# Altium project VESC_STM32F405.PrjPcb
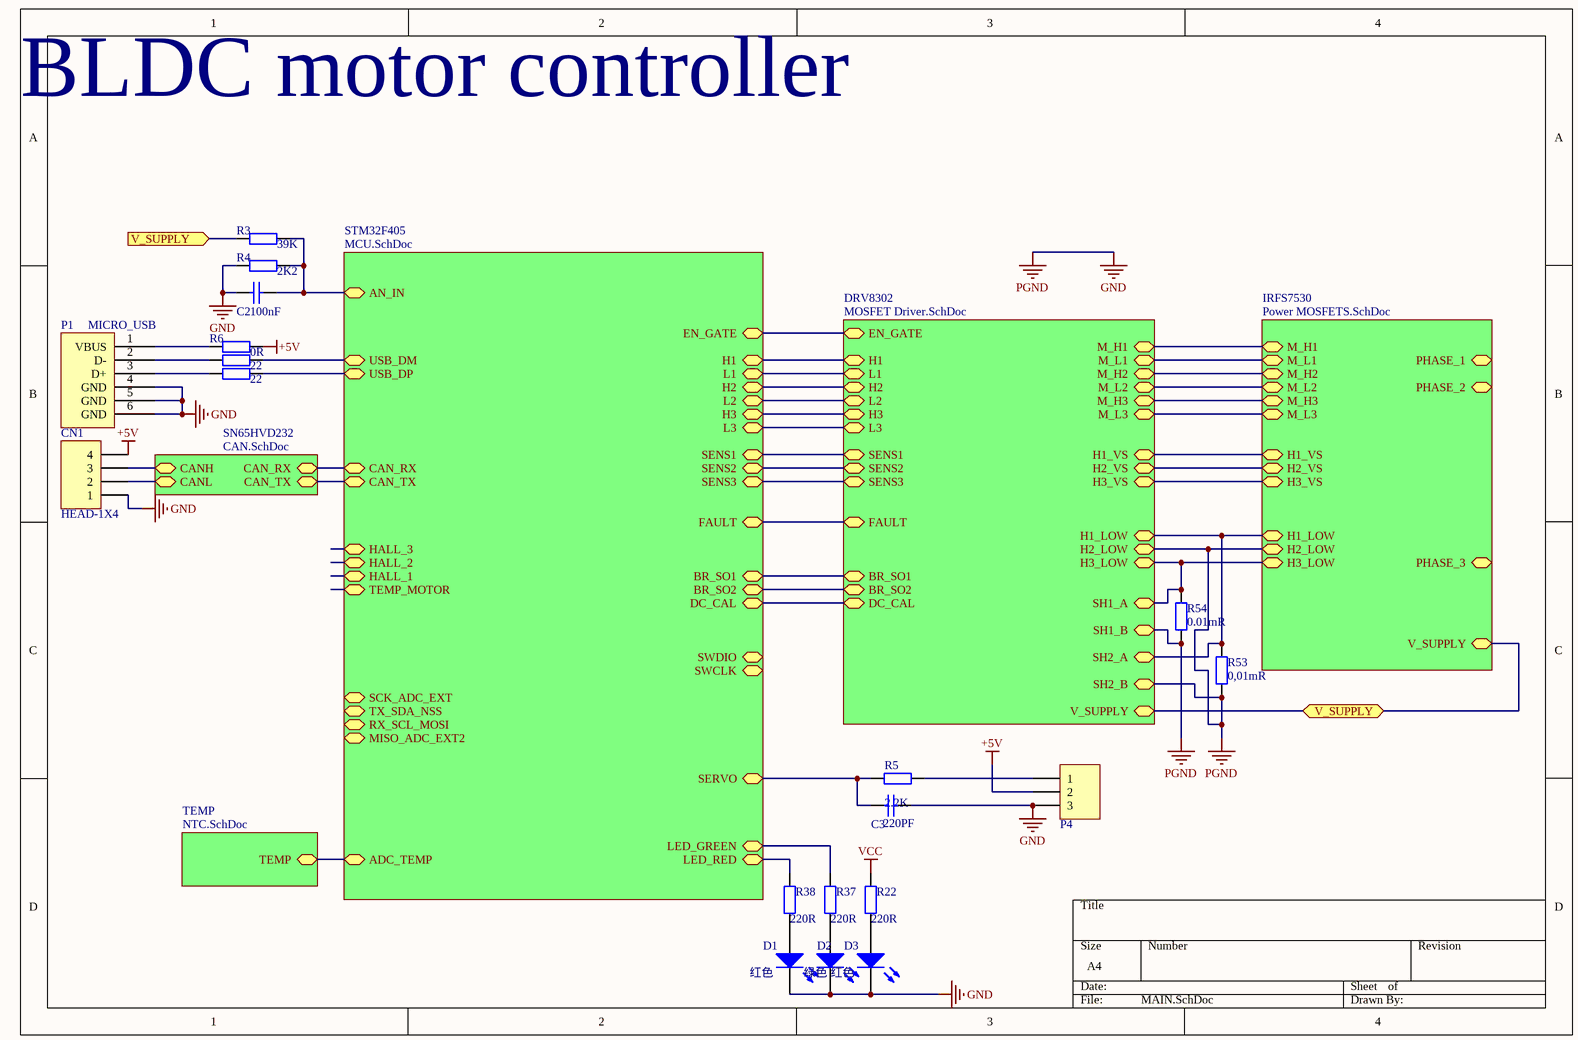
[diagram p0: MAIN.SchDoc]
6 sheets, 112 parts. Net scope: hierarchical (ports join the sheet entries above them; power ports are global).
Board file: VESC_909.PcbDoc
Sheets:
  MAIN.SchDoc
    STM32F405 = MCU.SchDoc
    DRV8302 = MOSFET Driver.SchDoc
    IRFS7530 = Power MOSFETS.SchDoc
    SN65HVD232 = CAN.SchDoc
    TEMP = NTC.SchDoc

## Sheet MAIN.SchDoc
size A4

### Parts
C2  value 100nF  [C-0603]  (hidden comment: CAP)
C3  220PF  [C-0603]
CN1  HEAD-1X4  [H-1X4]
D1  红色  [LED0603]
D2  绿色  [LED0603]
D3  红色  [LED0603]
P1  MICRO_USB  [MicroUSB]
P4  Header 3  [HDR3X1_A]  (value not drawn)
R3  39K  [0402]
R4  value 2K2  [0402]  (hidden comment: 2.2K)
R5  2.2K  [0402]
R6  0R  [0603-2]
R14  value 22  [LC-0402]  (hidden comment: 22R)
R15  value 22  [LC-0402]  (hidden comment: 22R)
R22  220R  [0402]
R37  220R  [0402]
R38  220R  [0402]
R53  value 0,01mR  [2512]  (hidden comment: 0.001R)
R54  value 0.01mR  [2512]  (hidden comment: 0.001R)

### Sub-sheets
DRV8302 = MOSFET Driver.SchDoc: DC_CAL, BR_SO2, BR_SO1, FAULT, SENS3, SENS2, SENS1, L3, H3, L2, H2, L1, H1, EN_GATE, M_H1, M_L1, M_H2, M_L2, M_H3, M_L3, H1_VS, H2_VS, H3_VS, H1_LOW, H2_LOW, H3_LOW, SH1_A, SH1_B, SH2_A, SH2_B, V_SUPPLY
IRFS7530 = Power MOSFETS.SchDoc: M_H1, M_L1, M_H2, M_L2, M_H3, M_L3, H1_VS, H2_VS, H3_VS, H1_LOW, H2_LOW, H3_LOW, PHASE_3, PHASE_2, PHASE_1, V_SUPPLY
SN65HVD232 = CAN.SchDoc: CANH, CANL, CAN_TX, CAN_RX
STM32F405 = MCU.SchDoc: AN_IN, USB_DM, USB_DP, CAN_RX, CAN_TX, HALL_3, HALL_2, HALL_1, TEMP_MOTOR, SCK_ADC_EXT, TX_SDA_NSS, RX_SCL_MOSI, MISO_ADC_EXT2, ADC_TEMP, EN_GATE, H1, L1, L2, H2, H3, L3, SENS1, SENS2, SENS3, FAULT, BR_SO1, BR_SO2, DC_CAL, SERVO, LED_GREEN, LED_RED, SWDIO, SWCLK
TEMP = NTC.SchDoc: TEMP

### Ports
V_SUPPLY, V_SUPPLY (in)

### Nets
+5V: CN1.4 P4.2 R6.2
GND: C2.1 C3.2 CN1.1 D1.2(K) D2.2(K) D3.2(K) P1.4(GND) P1.5(GND) P1.6(GND) P4.3 R4.1 R53.2 R54.2 ; sheet DRV8302/H2_LOW, sheet DRV8302/SH1_B, sheet DRV8302/SH2_B, sheet IRFS7530/H2_LOW  [also labelled PGND]
VCC: R22.2
NetC1_2: R3.1 ; port V_SUPPLY, sheet DRV8302/V_SUPPLY, sheet IRFS7530/V_SUPPLY
NetC2_2: C2.2 R3.2 R4.2 ; sheet STM32F405/AN_IN
NetC3_1: C3.1 R5.1 ; sheet STM32F405/SERVO
NetC28_2: sheet DRV8302/H1_VS, sheet IRFS7530/H1_VS, sheet IRFS7530/PHASE_1
NetC29_2: sheet DRV8302/H2_VS, sheet IRFS7530/H2_VS, sheet IRFS7530/PHASE_2
NetC30_2: sheet DRV8302/H3_VS, sheet IRFS7530/H3_VS, sheet IRFS7530/PHASE_3
NetCN1_2: CN1.2 ; sheet SN65HVD232/CANL
NetCN1_3: CN1.3 ; sheet SN65HVD232/CANH
NetCN_2: sheet STM32F405/ADC_TEMP, sheet TEMP/TEMP
NetD1_1: D1.1(A) R38.1
NetD2_1: D2.1(A) R37.1
NetD3_1: D3.1(A) R22.1
NetP1_1: P1.1(VBUS) R6.1
NetP1_2: P1.2(D-) R14.1
NetP1_3: P1.3(D+) R15.1
NetP4_1: P4.1 R5.2
NetQ2_1: R53.1 ; sheet DRV8302/H1_LOW, sheet DRV8302/SH2_A, sheet IRFS7530/H1_LOW
NetQ6_1: R54.1 ; sheet DRV8302/H3_LOW, sheet DRV8302/SH1_A, sheet IRFS7530/H3_LOW
NetR14_2: R14.2 ; sheet STM32F405/USB_DM
NetR15_2: R15.2 ; sheet STM32F405/USB_DP
NetR23_2: sheet STM32F405/SENS1, sheet DRV8302/SENS1
NetR26_2: sheet STM32F405/SENS2, sheet DRV8302/SENS2
NetR28_1: sheet DRV8302/M_H1, sheet IRFS7530/M_H1
NetR29_1: sheet DRV8302/M_L1, sheet IRFS7530/M_L1
NetR32_2: sheet STM32F405/SENS3, sheet DRV8302/SENS3
NetR34_1: sheet DRV8302/M_H2, sheet IRFS7530/M_H2
NetR35_1: sheet DRV8302/M_L2, sheet IRFS7530/M_L2
NetR37_2: R37.2 ; sheet STM32F405/LED_GREEN
NetR38_2: R38.2 ; sheet STM32F405/LED_RED
NetR42_1: sheet DRV8302/M_H3, sheet IRFS7530/M_H3
NetR43_1: sheet DRV8302/M_L3, sheet IRFS7530/M_L3
NetU1_1: sheet STM32F405/CAN_TX, sheet SN65HVD232/CAN_TX
NetU1_4: sheet STM32F405/CAN_RX, sheet SN65HVD232/CAN_RX
NetU2_26: sheet STM32F405/BR_SO2, sheet DRV8302/BR_SO2
NetU2_27: sheet STM32F405/BR_SO1, sheet DRV8302/BR_SO1
NetU2_33: sheet STM32F405/DC_CAL, sheet DRV8302/DC_CAL
NetU2_34: sheet STM32F405/L3, sheet DRV8302/L3
NetU2_35: sheet STM32F405/L2, sheet DRV8302/L2
NetU2_36: sheet STM32F405/L1, sheet DRV8302/L1
NetU2_41: sheet STM32F405/H3, sheet DRV8302/H3
NetU2_42: sheet STM32F405/H2, sheet DRV8302/H2
NetU2_43: sheet STM32F405/H1, sheet DRV8302/H1
NetU2_51: sheet STM32F405/EN_GATE, sheet DRV8302/EN_GATE
NetU2_53: sheet STM32F405/FAULT, sheet DRV8302/FAULT

### Notes on the sheet
- BLDC motor controller

### Library data of the parts
C2 = CAP: Capacitor; Published: 8-Jun-2000; Revision: July-2002: Re-released for DXP Platform.; Publisher: Altium Limited
C3 = CAP: Capacitor; Value: 100nF; Published: 8-Jun-2000; Revision: July-2002: Re-released for DXP Platform.; Publisher: Altium Limited
CN1 = HEAD-1X4: Header, 4-Pin; LatestRevisionDate: 17-Jul-2002; LatestRevisionNote: Re-released for DXP Platform.; Publisher: Altium Limited
D1-D3 = LED2: Typical RED, GREEN, YELLOW, AMBER GaAs LED; Published: 8-Jun-2000; LatestRevisionDate: 17-Jul-2002; LatestRevisionNote: Re-released for DXP Platform.; PackageVersion: Feb-2002; PackageReference: 3.2X1.6X1.1; Publisher: Altium Limited
P1 = MINI_USB: pin to pad: 6>0
P4 = Header 3_1: 接插件; LatestRevisionDate: 17-Jul-2002; LatestRevisionNote: Re-released for DXP Platform.; Publisher: Altium Limited
R3 R4 R6 R14 R15 R53 R54 = Res1: 贴片电阻; Published: 8-Jun-2000; LatestRevisionDate: 17-Jul-2002; LatestRevisionNote: Re-released for DXP Platform.; PackageReference: AXIAL-0.4; Publisher: Altium Limited
  R3: Value: 39K
  R6: Value: 0R
R5 R22 = Res1: 贴片电阻; Value: 2k2; Published: 8-Jun-2000; LatestRevisionDate: 17-Jul-2002; LatestRevisionNote: Re-released for DXP Platform.; PackageReference: AXIAL-0.4; Publisher: Altium Limited
R37 R38 = Res1: 贴片电阻; Value: 220; Published: 8-Jun-2000; LatestRevisionDate: 17-Jul-2002; LatestRevisionNote: Re-released for DXP Platform.; PackageReference: AXIAL-0.4; Publisher: Altium Limited

## Sheet MCU.SchDoc
size A4
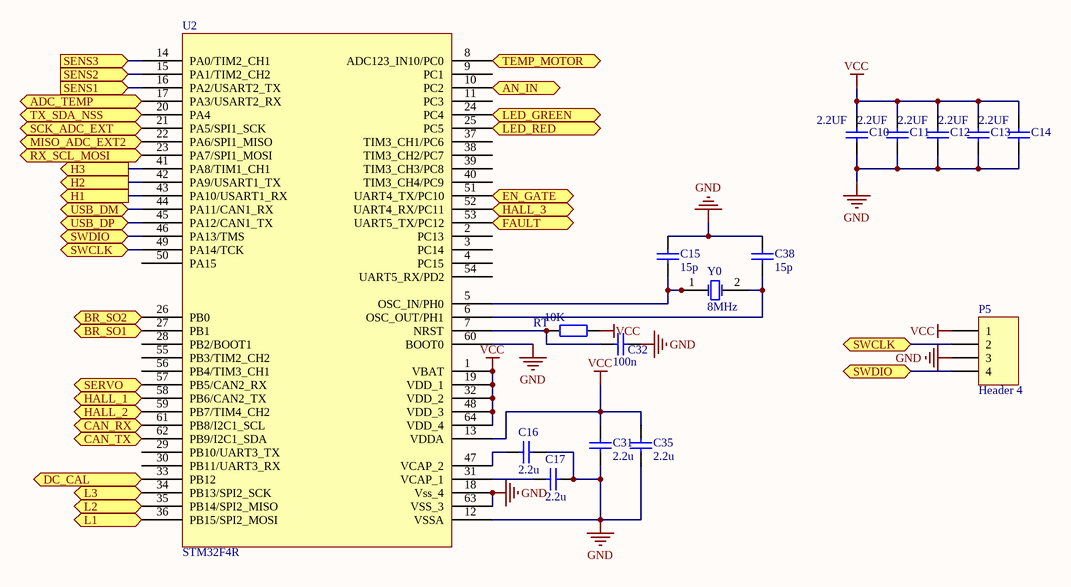
[diagram p1: MCU.SchDoc]

### Parts
C10  2.2UF  [C-0603]
C11  2.2UF  [C-0603]
C12  2.2UF  [C-0603]
C13  2.2UF  [C-0603]
C14  2.2UF  [C-0603]
C15  value 15p  [0402]  (hidden comment: 15PF)
C16  value 2.2u  [C-0603]  (hidden comment: 2.2UF)
C17  value 2.2u  [C-0603]  (hidden comment: 2.2UF)
C31  value 2.2u  [C-0603]  (hidden comment: 2.2UF)
C32  value 100n  [C-0603]  (hidden comment: 100NF)
C35  value 2.2u  [C-0603]  (hidden comment: 2.2UF)
C38  value 15p  [0402]  (hidden comment: 15PF)
P5  Header 4  [H-1X4]
RT  10K  [0603-2]
U2  STM32F4R  [STM32F4R]
Y0  8MHz  [XTAL_5032]

### Ports
ADC_TEMP, AN_IN (in), BR_SO1 (in), BR_SO2 (in), CAN_RX, CAN_TX, DC_CAL (in), EN_GATE (out), FAULT (in), H1 (out), H2 (out), H3 (out), HALL_1 (in), HALL_2 (in), HALL_3 (in), L1 (out), L2 (out), L3 (out), LED_GREEN (out), LED_RED (out), MISO_ADC_EXT2 (in), RX_SCL_MOSI (in), SCK_ADC_EXT (in), SENS1 (in), SENS2 (in), SENS3 (in), SERVO (out), SWCLK, SWDIO, TEMP_MOTOR (in), TX_SDA_NSS (in), USB_DM, USB_DP

### Nets
GND: C10.1 C11.1 C12.1 C13.1 C14.1 C15.2 C16.1 C17.1 C31.1 C32.1 C35.1 C38.2 P5.3 U2.12(VSSA) U2.18(Vss_4) U2.60(BOOT0) U2.63(VSS_3)
VCC: C10.2 C11.2 C12.2 C13.2 C14.2 C31.2 C35.2 P5.1 RT.2 U2.1(VBAT) U2.13(VDDA) U2.19(VDD_1) U2.32(VDD_2) U2.48(VDD_3) U2.64(VDD_4)
NetC2_2: U2.10(PC2) ; port AN_IN
NetC3_1: U2.57(PB5/CAN2_RX) ; port SERVO
NetC15_1: C15.1 U2.5(OSC_IN/PH0) Y0.1(OSC1)
NetC16_2: C16.2 U2.47(VCAP_2)
NetC17_2: C17.2 U2.31(VCAP_1)
NetC32_2: C32.2 RT.1 U2.7(NRST)
NetC38_1: C38.1 U2.6(OSC_OUT/PH1) Y0.2(OSC2)
NetCN_2: U2.17(PA3/USART2_RX) ; port ADC_TEMP
NetP5_2: P5.2 U2.49(PA14/TCK) ; port SWCLK
NetP5_4: P5.4 U2.46(PA13/TMS) ; port SWDIO
NetR14_2: U2.44(PA11/CAN1_RX) ; port USB_DM
NetR15_2: U2.45(PA12/CAN1_TX) ; port USB_DP
NetR23_2: U2.16(PA2/USART2_TX) ; port SENS1
NetR26_2: U2.15(PA1/TIM2_CH2) ; port SENS2
NetR32_2: U2.14(PA0/TIM2_CH1) ; port SENS3
NetR37_2: U2.24(PC4) ; port LED_GREEN
NetR38_2: U2.25(PC5) ; port LED_RED
NetU1_1: U2.62(PB9/I2C1_SDA) ; port CAN_TX
NetU1_4: U2.61(PB8/I2C1_SCL) ; port CAN_RX
NetU2_8: U2.8(ADC123_IN10/PC0) ; port TEMP_MOTOR
NetU2_20: U2.20(PA4) ; port TX_SDA_NSS
NetU2_21: U2.21(PA5/SPI1_SCK) ; port SCK_ADC_EXT
NetU2_22: U2.22(PA6/SPI1_MISO) ; port MISO_ADC_EXT2
NetU2_23: U2.23(PA7/SPI1_MOSI) ; port RX_SCL_MOSI
NetU2_26: U2.26(PB0) ; port BR_SO2
NetU2_27: U2.27(PB1) ; port BR_SO1
NetU2_33: U2.33(PB12) ; port DC_CAL
NetU2_34: U2.34(PB13/SPI2_SCK) ; port L3
NetU2_35: U2.35(PB14/SPI2_MISO) ; port L2
NetU2_36: U2.36(PB15/SPI2_MOSI) ; port L1
NetU2_41: U2.41(PA8/TIM1_CH1) ; port H3
NetU2_42: U2.42(PA9/USART1_TX) ; port H2
NetU2_43: U2.43(PA10/USART1_RX) ; port H1
NetU2_51: U2.51(UART4_TX/PC10) ; port EN_GATE
NetU2_52: U2.52(UART4_RX/PC11) ; port HALL_3
NetU2_53: U2.53(UART5_TX/PC12) ; port FAULT
NetU2_58: U2.58(PB6/CAN2_TX) ; port HALL_1
NetU2_59: U2.59(PB7/TIM4_CH2) ; port HALL_2

Not connected (* = marked no-connect by the designer): U2 2(PC13) 3(PC14) 4(PC15) 9(PC1) 11(PC3) 28(PB2/BOOT1) 29(PB10/UART3_TX) 30(PB11/UART3_RX) 37(TIM3_CH1/PC6) 38(TIM3_CH2/PC7) 39(TIM3_CH3/PC8) 40(TIM3_CH4/PC9) 50(PA15) 54(UART5_RX/PD2) 55(PB3/TIM2_CH2) 56(PB4/TIM3_CH1)

### Library data of the parts
C10-C14 = CAP: Capacitor; Value: 2.2u; Published: 8-Jun-2000; Revision: July-2002: Re-released for DXP Platform.; Publisher: Altium Limited
C15-C17 C31 C32 C35 C38 = CAP: Capacitor; Published: 8-Jun-2000; Revision: July-2002: Re-released for DXP Platform.; Publisher: Altium Limited
P5 = Header 4: Header, 4-Pin; LatestRevisionDate: 17-Jul-2002; LatestRevisionNote: Re-released for DXP Platform.; Publisher: Altium Limited
RT = Res1: 贴片电阻; Published: 8-Jun-2000; LatestRevisionDate: 17-Jul-2002; LatestRevisionNote: Re-released for DXP Platform.; PackageReference: AXIAL-0.4; Publisher: Altium Limited; Value: 10K
Y0 = XTAL: Crystal Oscillator; Published: 8-Jun-2000; LatestRevisionDate: 17-Jul-2002; LatestRevisionNote: Re-released for DXP Platform.; PackageReference: R38; Publisher: Altium Limited

## Sheet MOSFET Driver.SchDoc
size A4
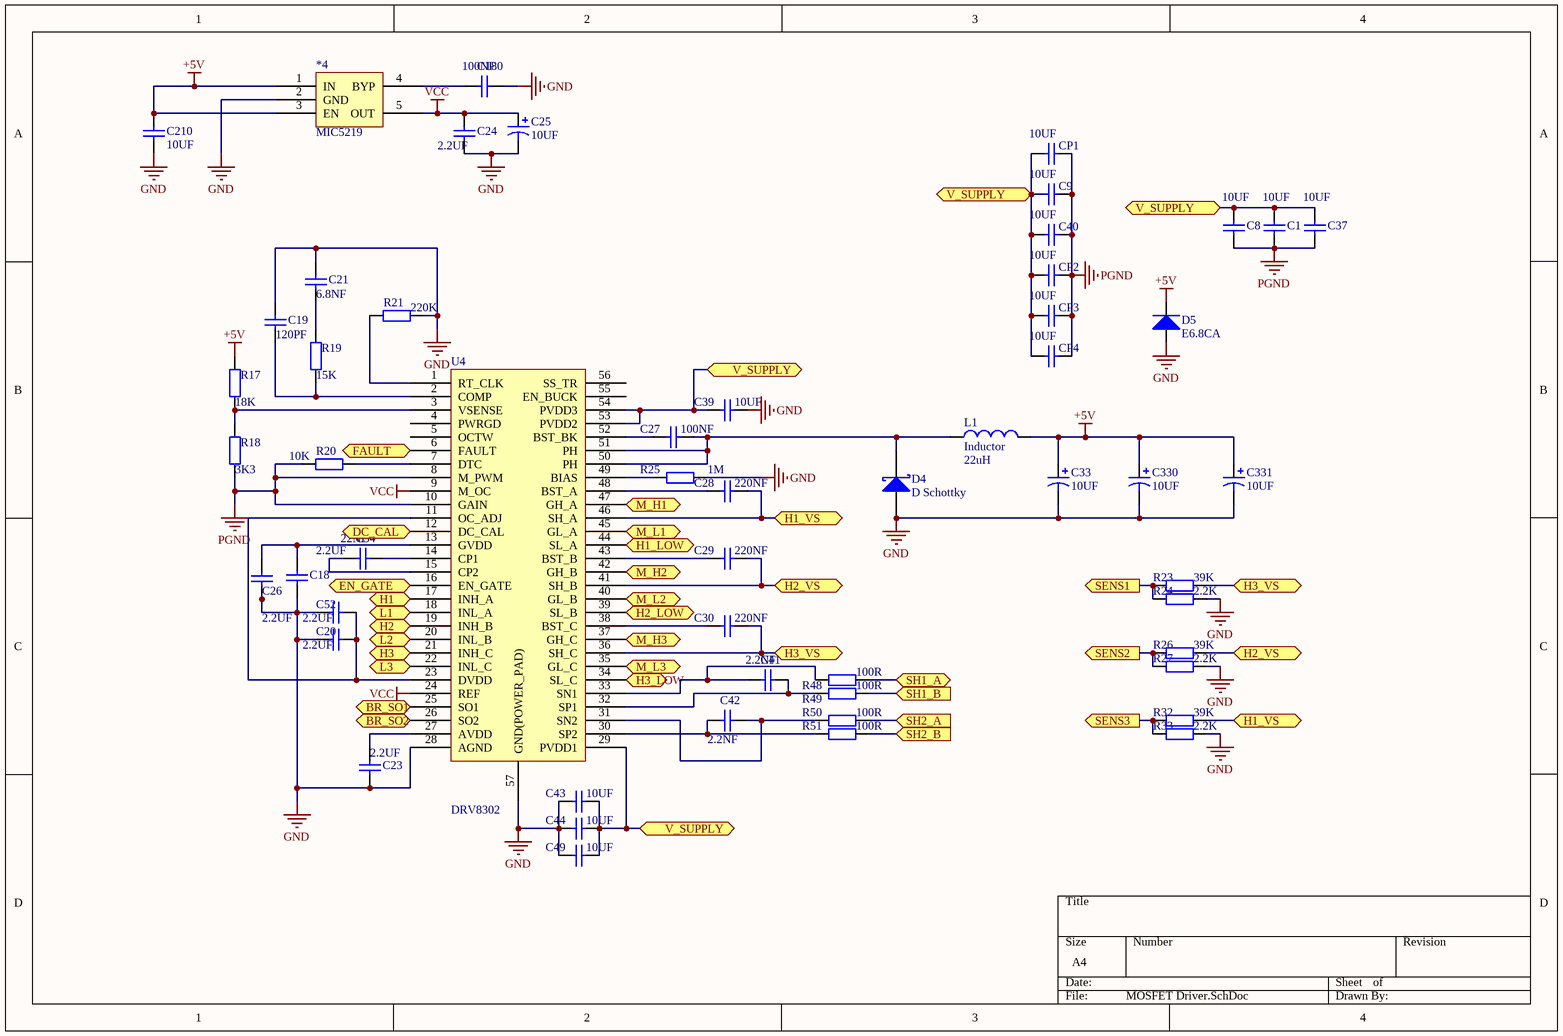
[diagram p2: MOSFET Driver.SchDoc]

### Parts
*4  MIC5219  [SOT23-5]
C1  10UF  [1812]
C8  10UF  [1206]
C9  10UF  [1206]
C18  2.2UF  [C-0603]
C19  120PF  [0402]
C20  2.2UF  [C-0603]
C21  6.8NF  [0402]
C23  2.2UF  [C-0603]
C24  2.2UF  [C-0603]
C25  10UF  [LC-1206]
C26  2.2UF  [C-0603]
C27  100NF  [C-0603]
C28  220NF  [C-0603]
C29  220NF  [C-0603]
C30  220NF  [C-0603]
C33  10UF  [C1206]
C34  22NF  [0402]
C37  10UF  [1812]
C39  10UF  [C1206A]
C40  10UF  [1206]
C41  2.2NF  [0402]
C42  2.2NF  [0402]
C43  10UF  [C1206A]
C44  10UF  [C1206A]
C49  10UF  [C1206A]
C52  2.2UF  [C-0603]
C180  100NF  [C-0603]
C210  10UF  [C-0603]
C330  10UF  [C1206]
C331  10UF  [C1206]
CP1  10UF  [1206]
CP2  10UF  [1206]
CP3  10UF  [1206]
CP4  10UF  [1206]
D4  D Schottky  [LC-SMA(DO-214AC)_S1]
D5  Type: E6.8CA  [DIODE-1206]  (hidden comment: TVS)
L1  Inductor  value 22uH  [L-SMD-7]
R17  18K  [0402]
R18  3K3  [0402]
R19  15K  [0402]
R20  10K  [0402]
R21  220K  [0402]
R23  39K  [0402]
R24  2.2K  [0402]
R25  1M  [0603-2]
R26  39K  [0402]
R27  2.2K  [0402]
R32  39K  [0402]
R33  2.2K  [0402]
R48  100R  [0402]
R49  100R  [0402]
R50  100R  [0402]
R51  100R  [0402]
U4  DRV8302  [HTSSOP-56]

### Ports
BR_SO1, BR_SO2, DC_CAL (in), EN_GATE (in), FAULT (out), H1 (in), H1_LOW, H1_VS, H2 (in), H2_LOW, H2_VS, H3 (in), H3_LOW, H3_VS, L1 (in), L2 (in), L3 (in), M_H1, M_H2, M_H3, M_L1, M_L2, M_L3, SENS1 (out), SENS2 (out), SENS3 (out), SH1_A, SH1_B (in), SH2_A (in), SH2_B (in), V_SUPPLY

### Nets
+5V: *4.1(IN) *4.3(EN) C33.1 C210.1 C330.1 C331.1 D5.2(K) L1.2 R17.2
GND: *4.2(GND) C1.1 C8.1 C9.2 C18.1 C19.1 C20.2 C21.1 C23.2 C24.2 C25.2 C26.1 C33.2 C37.1 C39.2 C40.2 C43.2 C44.2 C49.2 C52.2 C180.1 C210.2 C330.2 C331.2 CP1.2 CP2.2 CP3.2 CP4.2 D4.1(A) D5.1(A) R18.1 R20.2 R21.1 R24.1 R25.1 R27.1 R33.1 R49.1 R51.1 U4.8(M_PWM) U4.10(GAIN) U4.28(AGND) U4.39(SL_B) U4.57(GND(POWER_PAD)) ; port SH1_B, port SH2_B, port H2_LOW  [also labelled PGND]
VCC: *4.5(OUT) C24.1 C25.1 U4.9(M_OC) U4.24(REF)
Net*4_4: *4.4(BYP) C180.2
NetC1_2: C1.2 C8.2 C9.1 C37.2 C39.1 C40.1 C43.1 C44.1 C49.1 CP1.1 CP2.1 CP3.1 CP4.1 U4.29(PVDD1) U4.53(PVDD2) U4.54(PVDD3) ; port V_SUPPLY
NetC18_2: C18.2 C26.2 U4.13(GVDD)
NetC19_2: C19.2 R19.1 U4.2(COMP)
NetC20_1: C20.1 C52.1 U4.11(OC_ADJ) U4.23(DVDD)
NetC21_2: C21.2 R19.2
NetC23_1: C23.1 U4.27(AVDD)
NetC27_1: C27.1 U4.52(BST_BK)
NetC27_2: C27.2 D4.2(K) L1.1 U4.50(PH) U4.51(PH)
NetC28_1: C28.1 U4.48(BST_A)
NetC28_2: C28.2 R32.1 U4.46(SH_A) ; port H1_VS
NetC29_1: C29.1 U4.43(BST_B)
NetC29_2: C29.2 R26.1 U4.41(SH_B) ; port H2_VS
NetC30_1: C30.1 U4.38(BST_C)
NetC30_2: C30.2 R23.1 U4.36(SH_C) ; port H3_VS
NetC34_1: C34.1 U4.15(CP2)
NetC34_2: C34.2 U4.14(CP1)
NetC41_1: C41.1 R48.2 U4.33(SN1)
NetC41_2: C41.2 R49.2 U4.32(SP1)
NetC42_1: C42.1 R51.2 U4.30(SP2)
NetC42_2: C42.2 R50.2 U4.31(SN2)
NetQ2_1: R50.1 U4.44(SL_A) ; port SH2_A, port H1_LOW
NetQ6_1: R48.1 U4.34(SL_C) ; port SH1_A, port H3_LOW
NetR17_1: R17.1 R18.2 U4.3(VSENSE)
NetR20_1: R20.1 U4.7(DTC)
NetR21_2: R21.2 U4.1(RT_CLK)
NetR23_2: R23.2 R24.2 ; port SENS1
NetR25_2: R25.2 U4.49(BIAS)
NetR26_2: R26.2 R27.2 ; port SENS2
NetR28_1: U4.47(GH_A) ; port M_H1
NetR29_1: U4.45(GL_A) ; port M_L1
NetR32_2: R32.2 R33.2 ; port SENS3
NetR34_1: U4.42(GH_B) ; port M_H2
NetR35_1: U4.40(GL_B) ; port M_L2
NetR42_1: U4.37(GH_C) ; port M_H3
NetR43_1: U4.35(GL_C) ; port M_L3
NetU2_26: U4.26(SO2) ; port BR_SO2
NetU2_27: U4.25(SO1) ; port BR_SO1
NetU2_33: U4.12(DC_CAL) ; port DC_CAL
NetU2_34: U4.22(INL_C) ; port L3
NetU2_35: U4.20(INL_B) ; port L2
NetU2_36: U4.18(INL_A) ; port L1
NetU2_41: U4.21(INH_C) ; port H3
NetU2_42: U4.19(INH_B) ; port H2
NetU2_43: U4.17(INH_A) ; port H1
NetU2_51: U4.16(EN_GATE) ; port EN_GATE
NetU2_53: U4.6(FAULT) ; port FAULT

Not connected (* = marked no-connect by the designer): U4 4(PWRGD) 5(OCTW) 55(EN_BUCK) 56(SS_TR)

### Library data of the parts
C1 C37 = CAP: Capacitor; Value: 47u; Published: 8-Jun-2000; Revision: July-2002: Re-released for DXP Platform.; Publisher: Altium Limited
C8 C9 C39 C40 C43 C44 C49 CP1-CP4 = CAP: Capacitor; Value: 10u; Published: 8-Jun-2000; Revision: July-2002: Re-released for DXP Platform.; Publisher: Altium Limited
C18 C20 C23 C24 C26 C52 = CAP: Capacitor; Value: 2.2u; Published: 8-Jun-2000; Revision: July-2002: Re-released for DXP Platform.; Publisher: Altium Limited
C19 = CAP: Capacitor; Value: 120p; Published: 8-Jun-2000; Revision: July-2002: Re-released for DXP Platform.; Publisher: Altium Limited
C21 = CAP: Capacitor; Value: 6.8n; Published: 8-Jun-2000; Revision: July-2002: Re-released for DXP Platform.; Publisher: Altium Limited
C25 C33 C330 C331 = Cap Pol1: Polarized Capacitor (Radial); Value: 100u; Published: 8-Jun-2000; LatestRevisionDate: 17-Jul-2002; LatestRevisionNote: Re-released for DXP Platform.; PackageReference: RB7.6-15; Publisher: Altium Limited; PackageDescription: Polarized Capacitor (Radial); 2 Leads
C27 C180 C210 = CAP: Capacitor; Published: 8-Jun-2000; Revision: July-2002: Re-released for DXP Platform.; Publisher: Altium Limited
  C27: Value: 100nf
  C180: Value: 100nF
  C210: Value: 10UF
C28-C30 = CAP: Capacitor; Value: 220n; Published: 8-Jun-2000; Revision: July-2002: Re-released for DXP Platform.; Publisher: Altium Limited
C34 = CAP: Capacitor; Value: 22n; Published: 8-Jun-2000; Revision: July-2002: Re-released for DXP Platform.; Publisher: Altium Limited
C41 C42 = CAP: Capacitor; Value: 2.2n; Published: 8-Jun-2000; Revision: July-2002: Re-released for DXP Platform.; Publisher: Altium Limited
D4 = D Schottky: Schottky Diode; Published: 8-Jun-2000; LatestRevisionDate: 17-Jul-2002; LatestRevisionNote: Re-released for DXP Platform.; PackageReference: SMB; Publisher: Altium Limited; PackageDescription: DO-214-AA/SMB; 2 C-Bend Leads; Body 5.3 x 3.6 mm, inc. leads (LxW); Code_JEDEC: DO-214-AA
D5 = TVS: TVS保护; Published: 8-Jun-2000; LatestRevisionDate: 17-Jul-2002; LatestRevisionNote: Re-released for DXP Platform.; PackageDocument: Sep-1996; PackageReference: SMC; Publisher: Altium Limited; Code_JEDEC: DO-214-AB
L1 = Inductor: Code_IEC: 1005; Published: 8-Jun-2000; LatestRevisionDate: 29-May-2009; LatestRevisionNote: IPC-7351 Footprint Added.; PackageReference: 0402-A; Publisher: Altium Limited; PackageDescription: Chip Inductor; Code_JEITA: 0402
R17-R21 R23 R25 R26 R32 R48-R51 = Res1: 贴片电阻; Published: 8-Jun-2000; LatestRevisionDate: 17-Jul-2002; LatestRevisionNote: Re-released for DXP Platform.; PackageReference: AXIAL-0.4; Publisher: Altium Limited
  R17: Value: 18k
  R18: Value: 3k3
  R19: Value: 15k
  R20: Value: 10K
  R21: Value: 220k
  R23 R26 R32: Value: 39k
  R25: Value: 1M
  R48-R51: Value: 100R
R24 R27 R33 = Res1: 贴片电阻; Value: 2k2; Published: 8-Jun-2000; LatestRevisionDate: 17-Jul-2002; LatestRevisionNote: Re-released for DXP Platform.; PackageReference: AXIAL-0.4; Publisher: Altium Limited
U4 = DRV8302: 无刷直流驱动器

## Sheet Power MOSFETS.SchDoc
size A4
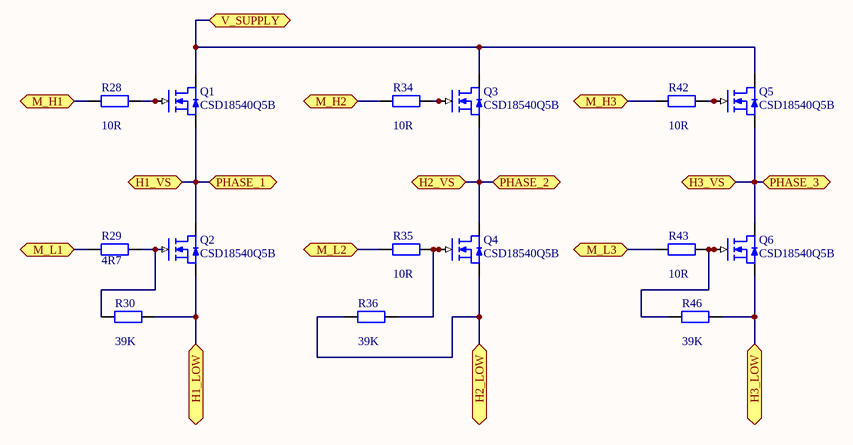
[diagram p3: Power MOSFETS.SchDoc]

### Parts
Q1  CSD18540Q5B  [SON5X6]
Q2  CSD18540Q5B  [SON5X6]
Q3  CSD18540Q5B  [SON5X6]
Q4  CSD18540Q5B  [SON5X6]
Q5  CSD18540Q5B  [SON5X6]
Q6  CSD18540Q5B  [SON5X6]
R28  10R  [0603-2]
R29  value 4R7  [0603-2]  (hidden comment: 10R)
R30  39K  [0603-2]
R34  10R  [0603-2]
R35  10R  [0603-2]
R36  39K  [0603-2]
R42  10R  [0603-2]
R43  10R  [0603-2]
R46  39K  [0603-2]

### Ports
H1_LOW, H1_VS, H2_LOW, H2_VS, H3_LOW, H3_VS, M_H1, M_H2, M_H3, M_L1, M_L2, M_L3, PHASE_1, PHASE_2, PHASE_3, V_SUPPLY

### Nets
GND: Q4.1(S) R36.1 ; port H2_LOW
NetC1_2: Q1.8(D) Q3.8(D) Q5.8(D) ; port V_SUPPLY
NetC28_2: Q1.1(S) Q2.8(D) ; port H1_VS, port PHASE_1
NetC29_2: Q3.1(S) Q4.8(D) ; port H2_VS, port PHASE_2
NetC30_2: Q5.1(S) Q6.8(D) ; port H3_VS, port PHASE_3
NetQ1_4: Q1.4(G) R28.2
NetQ2_1: Q2.1(S) R30.2 ; port H1_LOW
NetQ2_4: Q2.4(G) R29.2 R30.1
NetQ3_4: Q3.4(G) R34.2
NetQ4_4: Q4.4(G) R35.2 R36.2
NetQ5_4: Q5.4(G) R42.2
NetQ6_1: Q6.1(S) R46.2 ; port H3_LOW
NetQ6_4: Q6.4(G) R43.2 R46.1
NetR28_1: R28.1 ; port M_H1
NetR29_1: R29.1 ; port M_L1
NetR34_1: R34.1 ; port M_H2
NetR35_1: R35.1 ; port M_L2
NetR42_1: R42.1 ; port M_H3
NetR43_1: R43.1 ; port M_L3

### Library data of the parts
R28 R34 R35 R42 R43 = Res1: 贴片电阻; Value: 4R7; Published: 8-Jun-2000; LatestRevisionDate: 17-Jul-2002; LatestRevisionNote: Re-released for DXP Platform.; PackageReference: AXIAL-0.4; Publisher: Altium Limited
R29 R30 R36 R46 = Res1: 贴片电阻; Published: 8-Jun-2000; LatestRevisionDate: 17-Jul-2002; LatestRevisionNote: Re-released for DXP Platform.; PackageReference: AXIAL-0.4; Publisher: Altium Limited
  R30 R36 R46: Value: 39k

## Sheet CAN.SchDoc
size A4
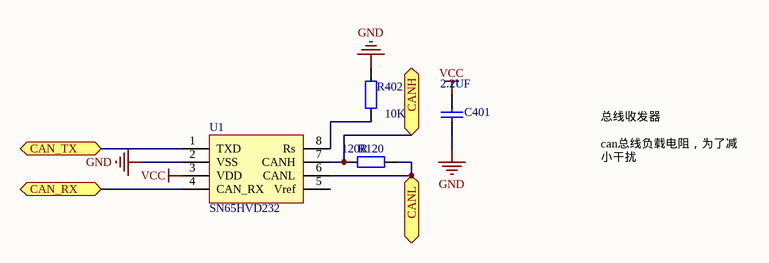
[diagram p4: CAN.SchDoc]

### Parts
C401  2.2UF  [C-0603]
R120  120R  [0603-2]
R402  10K  [0603-2]
U1  SN65HVD232  [SOIC8_N]

### Ports
CAN_RX, CAN_TX, CANH, CANL

### Nets
GND: C401.1 R402.2 U1.2(VSS)
VCC: C401.2 U1.3(VDD)
NetCN1_2: R120.1 U1.6(CANL) ; port CANL
NetCN1_3: R120.2 U1.7(CANH) ; port CANH
NetR402_1: R402.1 U1.8(Rs)
NetU1_1: U1.1(TXD) ; port CAN_TX
NetU1_4: U1.4(CAN_RX) ; port CAN_RX

Not connected (* = marked no-connect by the designer): U1 5(Vref)

### Notes on the sheet
- 总线收发器
  can总线负载电阻，为了减小干扰

### Library data of the parts
C401 = CAP: Capacitor; Published: 8-Jun-2000; Revision: July-2002: Re-released for DXP Platform.; Publisher: Altium Limited; Value: 2.2uF
R120 R402 = Res1: 贴片电阻; Published: 8-Jun-2000; LatestRevisionDate: 17-Jul-2002; LatestRevisionNote: Re-released for DXP Platform.; PackageReference: AXIAL-0.4; Publisher: Altium Limited
  R120: Value: 120R
  R402: Value: 10k
U1 = AT24C02_1: CAN收发器

## Sheet NTC.SchDoc
size A4
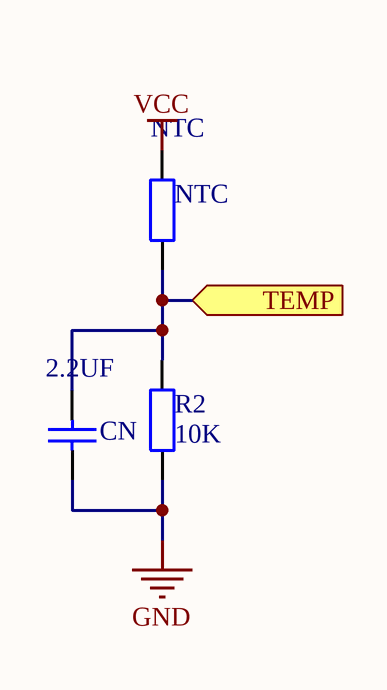
[diagram p5: NTC.SchDoc]

### Parts
CN  2.2UF  [C-0603]
NTC  NTC  [0603-2]
R2  10K  [0402]

### Ports
TEMP (in)

### Nets
GND: CN.1 R2.1
VCC: NTC.2
NetCN_2: CN.2 NTC.1 R2.2 ; port TEMP

### Library data of the parts
CN = CAP: Capacitor; Published: 8-Jun-2000; Revision: July-2002: Re-released for DXP Platform.; Publisher: Altium Limited; Value: 2.2uF
NTC = Res1: 贴片电阻; Value: 10K; Published: 8-Jun-2000; LatestRevisionDate: 17-Jul-2002; LatestRevisionNote: Re-released for DXP Platform.; PackageReference: AXIAL-0.4; Publisher: Altium Limited
R2 = Res1: 贴片电阻; Published: 8-Jun-2000; LatestRevisionDate: 17-Jul-2002; LatestRevisionNote: Re-released for DXP Platform.; PackageReference: AXIAL-0.4; Publisher: Altium Limited; Value: 10K

## Nets that join several sheets
+5V: MAIN (CN1.4 P4.2 R6.2), MOSFET Driver (9 pins)
GND: MAIN (13 pins), MCU (17 pins), MOSFET Driver (44 pins), Power MOSFETS (Q4.1 R36.1), CAN (C401.1 R402.2 U1.2), NTC (CN.1 R2.1)
VCC: MAIN (R22.2), MCU (15 pins), MOSFET Driver (5 pins), CAN (C401.2 U1.3), NTC (NTC.2)
NetC1_2: MAIN (R3.1), MOSFET Driver (16 pins), Power MOSFETS (Q1.8 Q3.8 Q5.8)
NetC2_2: MAIN (C2.2 R3.2 R4.2), MCU (U2.10)
NetC3_1: MAIN (C3.1 R5.1), MCU (U2.57)
NetC28_2: MOSFET Driver (C28.2 R32.1 U4.46), Power MOSFETS (Q1.1 Q2.8)
NetC29_2: MOSFET Driver (C29.2 R26.1 U4.41), Power MOSFETS (Q3.1 Q4.8)
NetC30_2: MOSFET Driver (C30.2 R23.1 U4.36), Power MOSFETS (Q5.1 Q6.8)
NetCN1_2: MAIN (CN1.2), CAN (R120.1 U1.6)
NetCN1_3: MAIN (CN1.3), CAN (R120.2 U1.7)
NetCN_2: MCU (U2.17), NTC (CN.2 NTC.1 R2.2)
NetQ2_1: MAIN (R53.1), MOSFET Driver (R50.1 U4.44), Power MOSFETS (Q2.1 R30.2)
NetQ6_1: MAIN (R54.1), MOSFET Driver (R48.1 U4.34), Power MOSFETS (Q6.1 R46.2)
NetR14_2: MAIN (R14.2), MCU (U2.44)
NetR15_2: MAIN (R15.2), MCU (U2.45)
NetR23_2: MCU (U2.16), MOSFET Driver (R23.2 R24.2)
NetR26_2: MCU (U2.15), MOSFET Driver (R26.2 R27.2)
NetR28_1: MOSFET Driver (U4.47), Power MOSFETS (R28.1)
NetR29_1: MOSFET Driver (U4.45), Power MOSFETS (R29.1)
NetR32_2: MCU (U2.14), MOSFET Driver (R32.2 R33.2)
NetR34_1: MOSFET Driver (U4.42), Power MOSFETS (R34.1)
NetR35_1: MOSFET Driver (U4.40), Power MOSFETS (R35.1)
NetR37_2: MAIN (R37.2), MCU (U2.24)
NetR38_2: MAIN (R38.2), MCU (U2.25)
NetR42_1: MOSFET Driver (U4.37), Power MOSFETS (R42.1)
NetR43_1: MOSFET Driver (U4.35), Power MOSFETS (R43.1)
NetU1_1: MCU (U2.62), CAN (U1.1)
NetU1_4: MCU (U2.61), CAN (U1.4)
NetU2_26: MCU (U2.26), MOSFET Driver (U4.26)
NetU2_27: MCU (U2.27), MOSFET Driver (U4.25)
NetU2_33: MCU (U2.33), MOSFET Driver (U4.12)
NetU2_34: MCU (U2.34), MOSFET Driver (U4.22)
NetU2_35: MCU (U2.35), MOSFET Driver (U4.20)
NetU2_36: MCU (U2.36), MOSFET Driver (U4.18)
NetU2_41: MCU (U2.41), MOSFET Driver (U4.21)
NetU2_42: MCU (U2.42), MOSFET Driver (U4.19)
NetU2_43: MCU (U2.43), MOSFET Driver (U4.17)
NetU2_51: MCU (U2.51), MOSFET Driver (U4.16)
NetU2_53: MCU (U2.53), MOSFET Driver (U4.6)